# EAGLE design Teknic_motor_io (EAGLE 9.6.2)
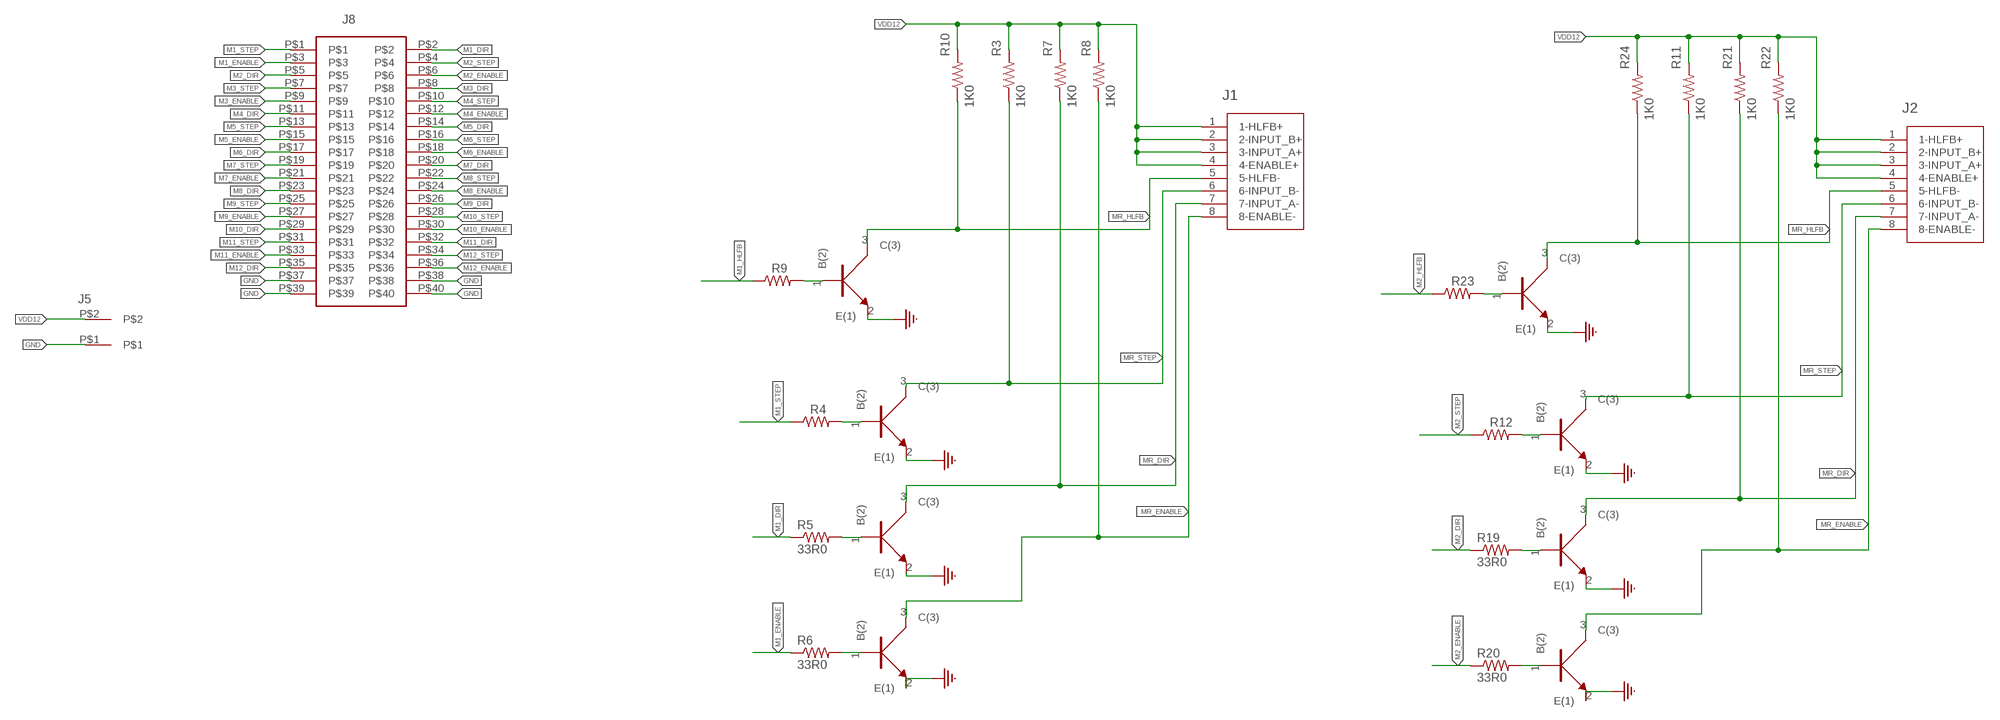
[diagram p0: schematic, sheet 1, part 1 of 3]
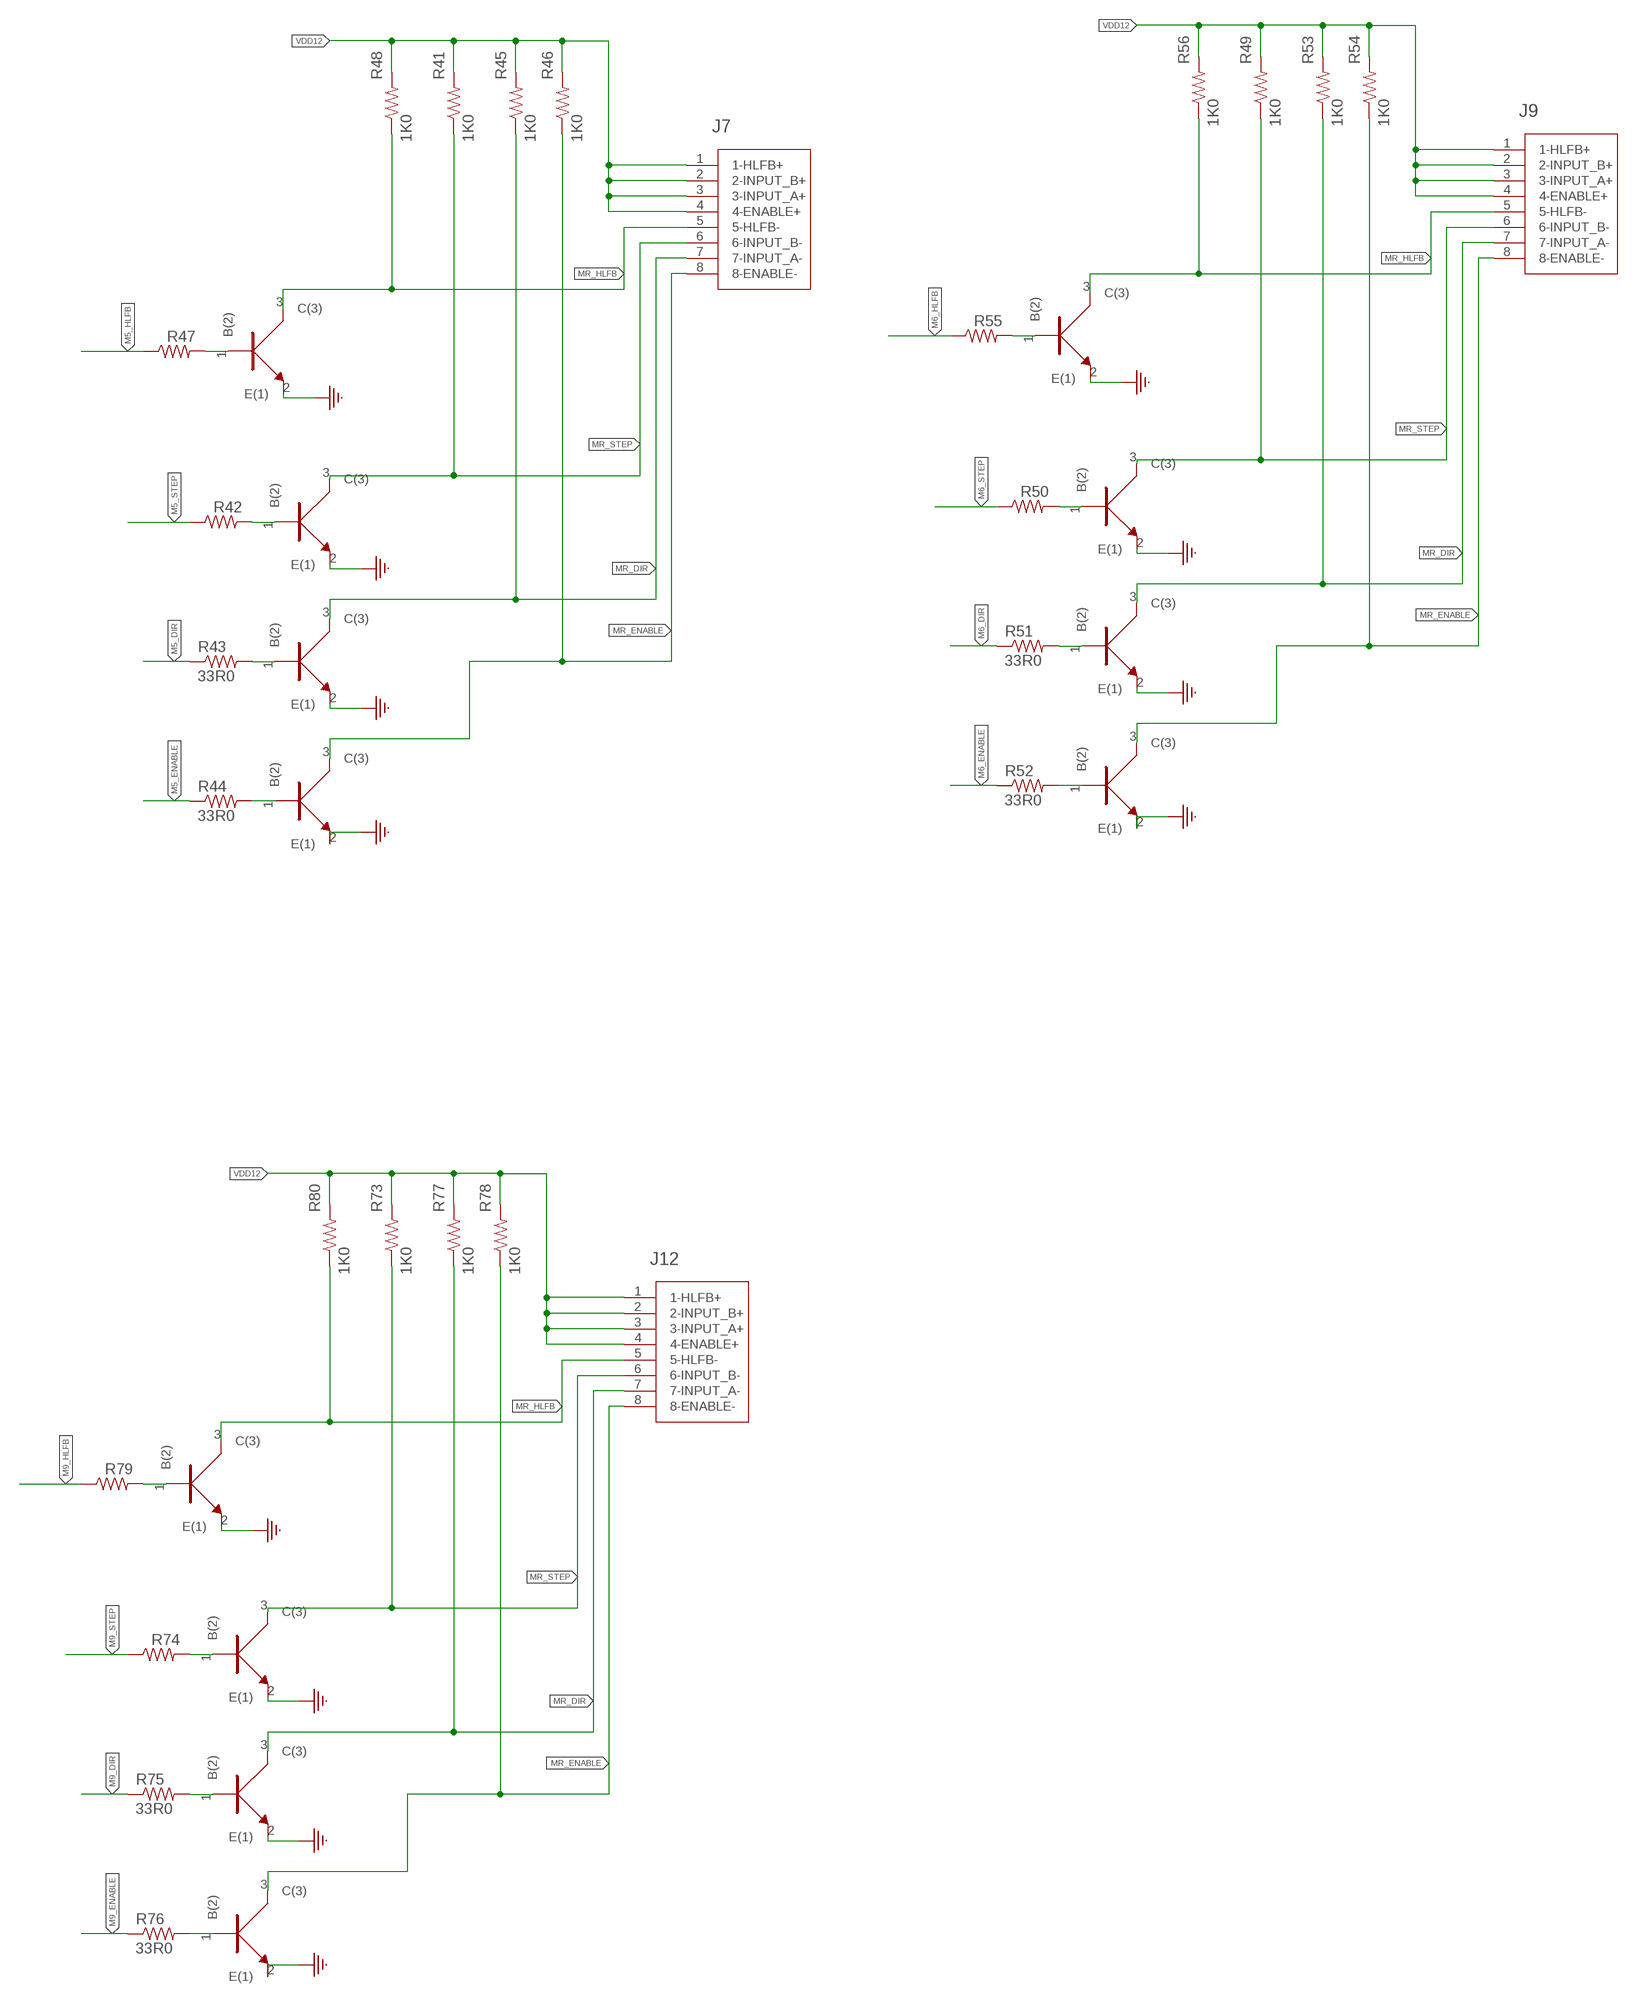
[diagram p1: schematic, sheet 1, part 2 of 3]
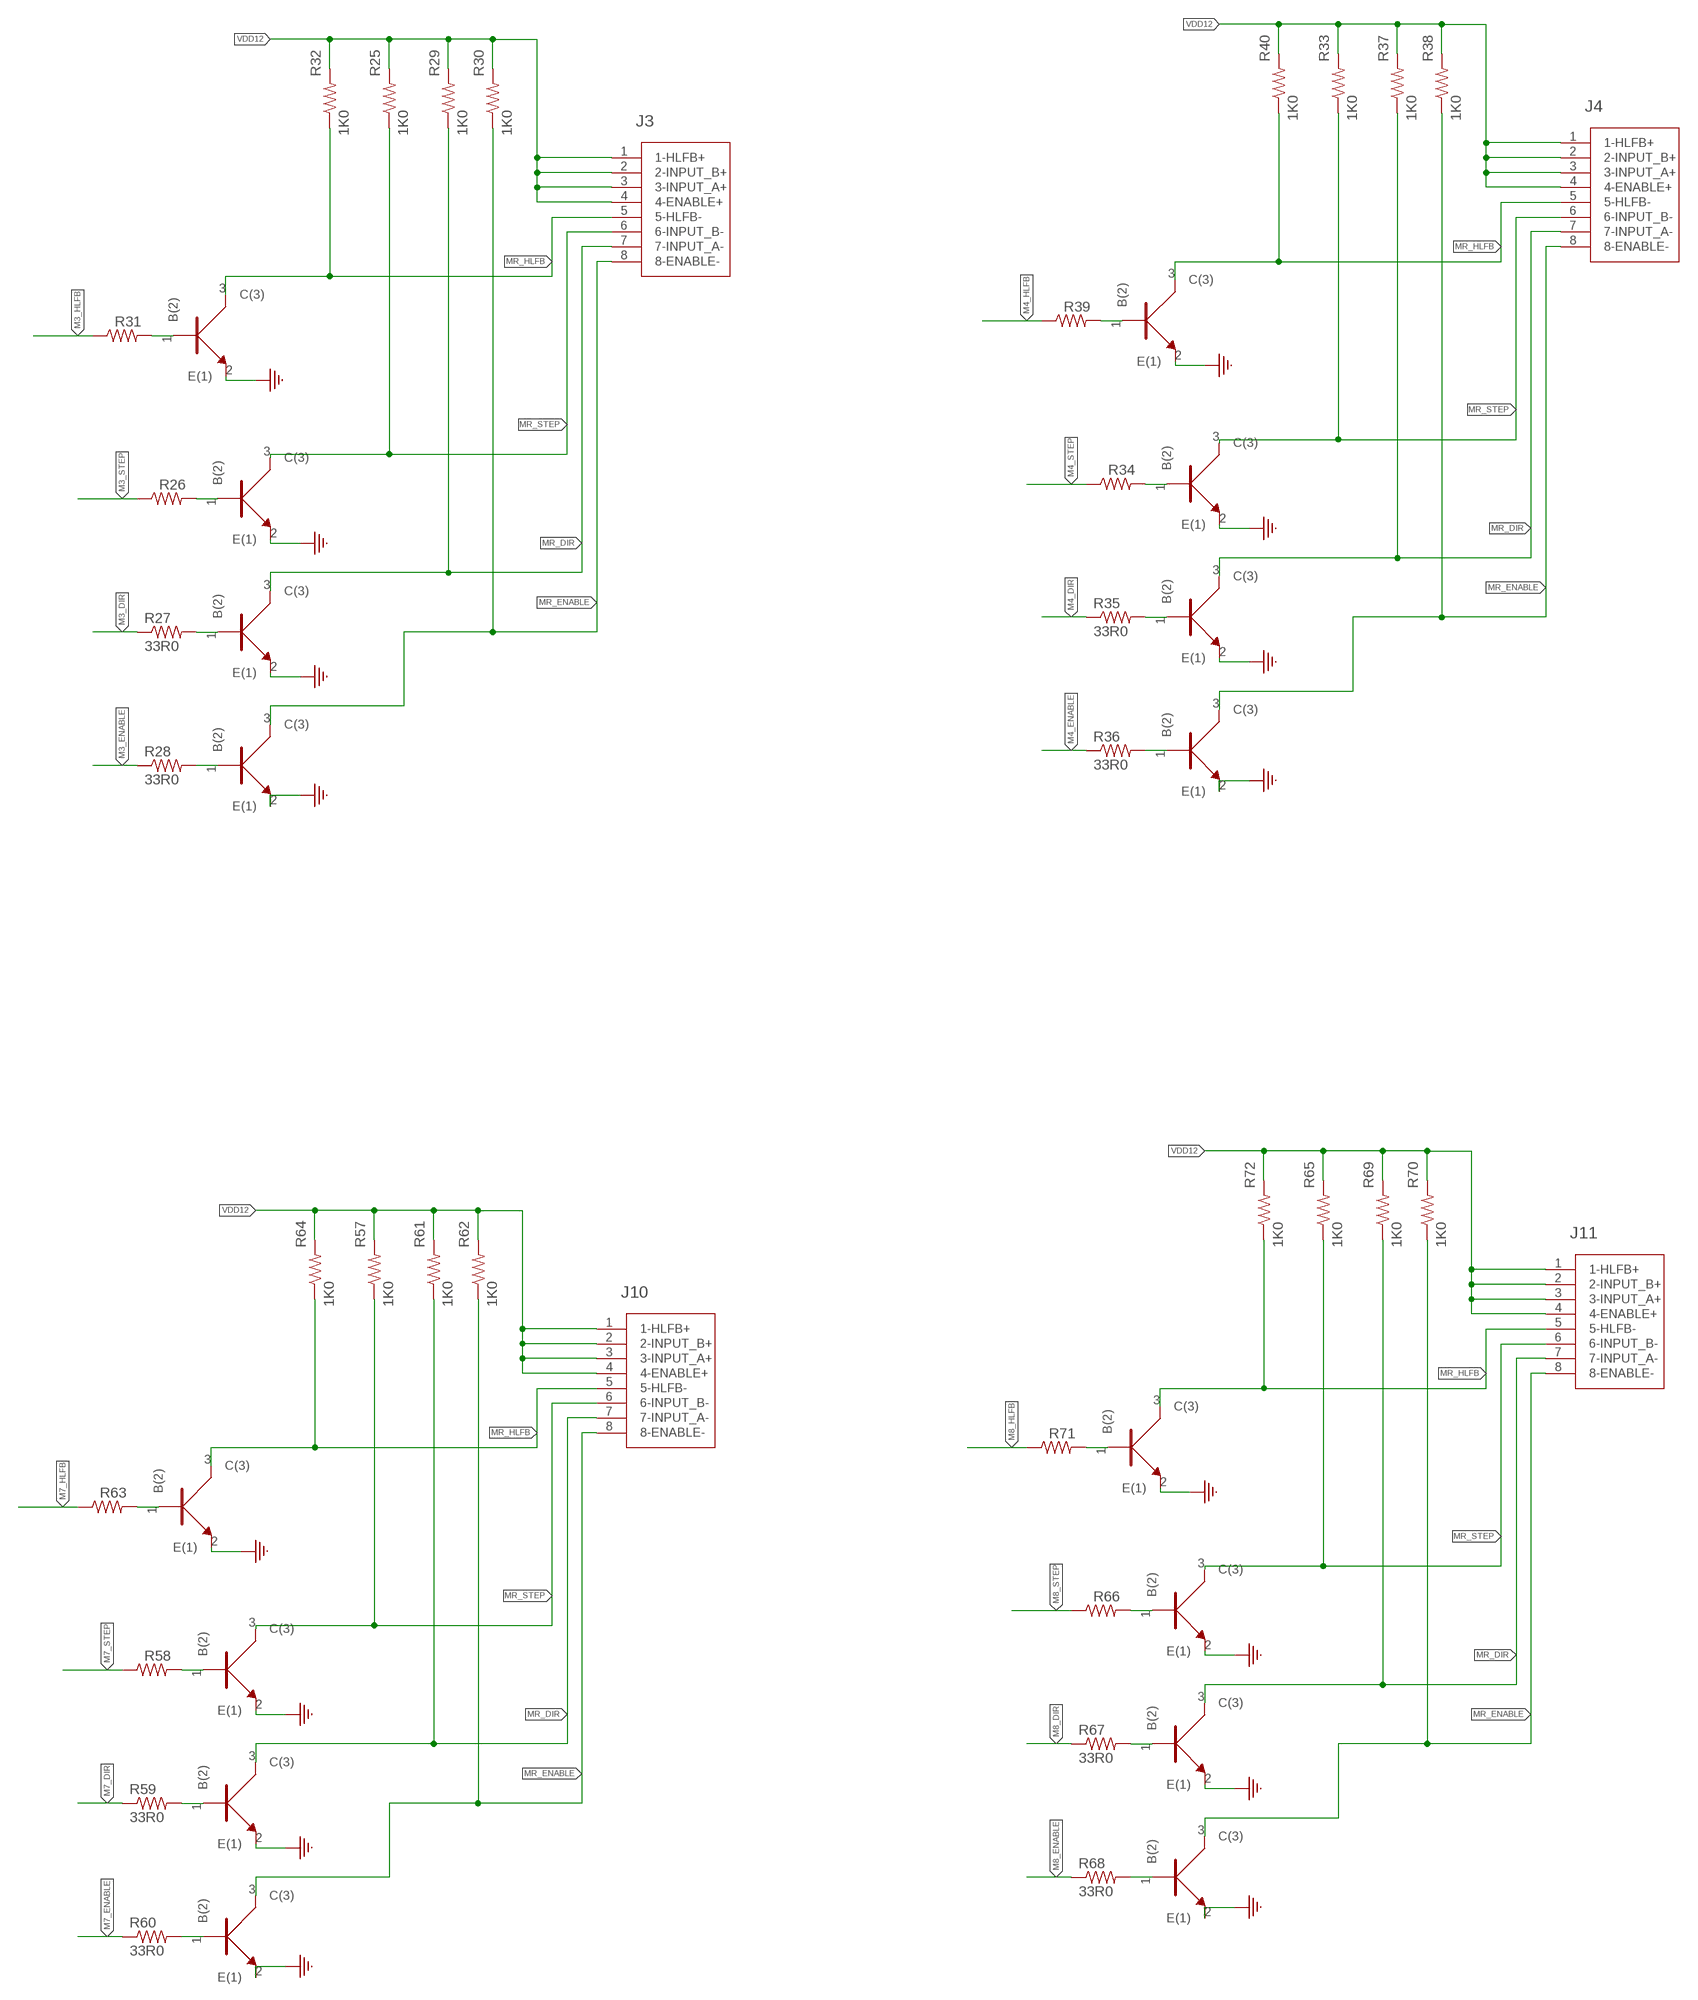
[diagram p2: schematic, sheet 1, part 3 of 3]

## Parts
J1  TEKNIC_8PIN_MOTOR  [CON_39281083]
J2  TEKNIC_8PIN_MOTOR  [CON_39281083]
J3  TEKNIC_8PIN_MOTOR  [CON_39281083]
J4  TEKNIC_8PIN_MOTOR  [CON_39281083]
J5  2-pos  3.81MM_1_X_2_RT_ANGLE_PLUG_HEADER  [2_3.81MM_PITCH]
J7  TEKNIC_8PIN_MOTOR  [CON_39281083]
J8  40-pos  HEADER_2_X_20_GENERIC  [HEADER_2_X_20_.1_INCH]
J9  TEKNIC_8PIN_MOTOR  [CON_39281083]
J10  TEKNIC_8PIN_MOTOR  [CON_39281083]
J11  TEKNIC_8PIN_MOTOR  [CON_39281083]
J12  TEKNIC_8PIN_MOTOR  [CON_39281083]
R3  1K0  R_0402_1K0  [0402]
R4  33R0  R_0402_33R0  [0402]
R5  33R0  R_0402_33R0  [0402]
R6  33R0  R_0402_33R0  [0402]
R7  1K0  R_0402_1K0  [0402]
R8  1K0  R_0402_1K0  [0402]
R9  33R0  R_0402_33R0  [0402]
R10  1K0  R_0402_1K0  [0402]
R11  1K0  R_0402_1K0  [0402]
R12  33R0  R_0402_33R0  [0402]
R19  33R0  R_0402_33R0  [0402]
R20  33R0  R_0402_33R0  [0402]
R21  1K0  R_0402_1K0  [0402]
R22  1K0  R_0402_1K0  [0402]
R23  33R0  R_0402_33R0  [0402]
R24  1K0  R_0402_1K0  [0402]
R25  1K0  R_0402_1K0  [0402]
R26  33R0  R_0402_33R0  [0402]
R27  33R0  R_0402_33R0  [0402]
R28  33R0  R_0402_33R0  [0402]
R29  1K0  R_0402_1K0  [0402]
R30  1K0  R_0402_1K0  [0402]
R31  33R0  R_0402_33R0  [0402]
R32  1K0  R_0402_1K0  [0402]
R33  1K0  R_0402_1K0  [0402]
R34  33R0  R_0402_33R0  [0402]
R35  33R0  R_0402_33R0  [0402]
R36  33R0  R_0402_33R0  [0402]
R37  1K0  R_0402_1K0  [0402]
R38  1K0  R_0402_1K0  [0402]
R39  33R0  R_0402_33R0  [0402]
R40  1K0  R_0402_1K0  [0402]
R41  1K0  R_0402_1K0  [0402]
R42  33R0  R_0402_33R0  [0402]
R43  33R0  R_0402_33R0  [0402]
R44  33R0  R_0402_33R0  [0402]
R45  1K0  R_0402_1K0  [0402]
R46  1K0  R_0402_1K0  [0402]
R47  33R0  R_0402_33R0  [0402]
R48  1K0  R_0402_1K0  [0402]
R49  1K0  R_0402_1K0  [0402]
R50  33R0  R_0402_33R0  [0402]
R51  33R0  R_0402_33R0  [0402]
R52  33R0  R_0402_33R0  [0402]
R53  1K0  R_0402_1K0  [0402]
R54  1K0  R_0402_1K0  [0402]
R55  33R0  R_0402_33R0  [0402]
R56  1K0  R_0402_1K0  [0402]
R57  1K0  R_0402_1K0  [0402]
R58  33R0  R_0402_33R0  [0402]
R59  33R0  R_0402_33R0  [0402]
R60  33R0  R_0402_33R0  [0402]
R61  1K0  R_0402_1K0  [0402]
R62  1K0  R_0402_1K0  [0402]
R63  33R0  R_0402_33R0  [0402]
R64  1K0  R_0402_1K0  [0402]
R65  1K0  R_0402_1K0  [0402]
R66  33R0  R_0402_33R0  [0402]
R67  33R0  R_0402_33R0  [0402]
R68  33R0  R_0402_33R0  [0402]
R69  1K0  R_0402_1K0  [0402]
R70  1K0  R_0402_1K0  [0402]
R71  33R0  R_0402_33R0  [0402]
R72  1K0  R_0402_1K0  [0402]
R73  1K0  R_0402_1K0  [0402]
R74  33R0  R_0402_33R0  [0402]
R75  33R0  R_0402_33R0  [0402]
R76  33R0  R_0402_33R0  [0402]
R77  1K0  R_0402_1K0  [0402]
R78  1K0  R_0402_1K0  [0402]
R79  33R0  R_0402_33R0  [0402]
R80  1K0  R_0402_1K0  [0402]
U2  NPN  BC846BW  [SOT323]
U3  NPN  BC846BW  [SOT323]
U4  NPN  BC846BW  [SOT323]
U5  NPN  BC846BW  [SOT323]
U6  NPN  BC846BW  [SOT323]
U10  NPN  BC846BW  [SOT323]
U11  NPN  BC846BW  [SOT323]
U12  NPN  BC846BW  [SOT323]
U13  NPN  BC846BW  [SOT323]
U14  NPN  BC846BW  [SOT323]
U15  NPN  BC846BW  [SOT323]
U16  NPN  BC846BW  [SOT323]
U17  NPN  BC846BW  [SOT323]
U18  NPN  BC846BW  [SOT323]
U19  NPN  BC846BW  [SOT323]
U20  NPN  BC846BW  [SOT323]
U21  NPN  BC846BW  [SOT323]
U22  NPN  BC846BW  [SOT323]
U23  NPN  BC846BW  [SOT323]
U24  NPN  BC846BW  [SOT323]
U25  NPN  BC846BW  [SOT323]
U26  NPN  BC846BW  [SOT323]
U27  NPN  BC846BW  [SOT323]
U28  NPN  BC846BW  [SOT323]
U29  NPN  BC846BW  [SOT323]
U30  NPN  BC846BW  [SOT323]
U31  NPN  BC846BW  [SOT323]
U32  NPN  BC846BW  [SOT323]
U33  NPN  BC846BW  [SOT323]
U34  NPN  BC846BW  [SOT323]
U35  NPN  BC846BW  [SOT323]
U36  NPN  BC846BW  [SOT323]
U37  NPN  BC846BW  [SOT323]
U38  NPN  BC846BW  [SOT323]
U39  NPN  BC846BW  [SOT323]
U40  NPN  BC846BW  [SOT323]

## Nets
GND: J5.P$1 J8.P$37 J8.P$38 J8.P$39 J8.P$40 U2.2(E(1)) U3.2(E(1)) U4.2(E(1)) U5.2(E(1)) U6.2(E(1)) U10.2(E(1)) U11.2(E(1)) U12.2(E(1)) U13.2(E(1)) U14.2(E(1)) U15.2(E(1)) U16.2(E(1)) U17.2(E(1)) U18.2(E(1)) U19.2(E(1)) U20.2(E(1)) U21.2(E(1)) U22.2(E(1)) U23.2(E(1)) U24.2(E(1)) U25.2(E(1)) U26.2(E(1)) U27.2(E(1)) U28.2(E(1)) U29.2(E(1)) U30.2(E(1)) U31.2(E(1)) U32.2(E(1)) U33.2(E(1)) U34.2(E(1)) U35.2(E(1)) U36.2(E(1)) U37.2(E(1)) U38.2(E(1)) U39.2(E(1)) U40.2(E(1))
M1_DIR: J8.P$2 R5.P$1
M1_ENABLE: J8.P$3 R6.P$1
M1_HLFB: R9.P$1
M1_STEP: J8.P$1 R4.P$1
M2_DIR: J8.P$5 R19.P$1
M2_ENABLE: J8.P$6 R20.P$1
M2_HLFB: R23.P$1
M2_STEP: J8.P$4 R12.P$1
M3_DIR: J8.P$8 R27.P$1
M3_ENABLE: J8.P$9 R28.P$1
M3_HLFB: R31.P$1
M3_STEP: J8.P$7 R26.P$1
M4_DIR: J8.P$11 R35.P$1
M4_ENABLE: J8.P$12 R36.P$1
M4_HLFB: R39.P$1
M4_STEP: J8.P$10 R34.P$1
M5_DIR: J8.P$14 R43.P$1
M5_ENABLE: J8.P$15 R44.P$1
M5_HLFB: R47.P$1
M5_STEP: J8.P$13 R42.P$1
M6_DIR: J8.P$17 R51.P$1
M6_ENABLE: J8.P$18 R52.P$1
M6_HLFB: R55.P$1
M6_STEP: J8.P$16 R50.P$1
M7_DIR: J8.P$20 R59.P$1
M7_ENABLE: J8.P$21 R60.P$1
M7_HLFB: R63.P$1
M7_STEP: J8.P$19 R58.P$1
M8_DIR: J8.P$23 R67.P$1
M8_ENABLE: J8.P$24 R68.P$1
M8_HLFB: R71.P$1
M8_STEP: J8.P$22 R66.P$1
M9_DIR: J8.P$26 R75.P$1
M9_ENABLE: J8.P$27 R76.P$1
M9_HLFB: R79.P$1
M9_STEP: J8.P$25 R74.P$1
M10_DIR: J8.P$29
M10_ENABLE: J8.P$30
M10_STEP: J8.P$28
M11_DIR: J8.P$32
M11_ENABLE: J8.P$33
M11_STEP: J8.P$31
M12_DIR: J8.P$35
M12_ENABLE: J8.P$36
M12_STEP: J8.P$34
MR_DIR: J1.7(7-INPUT_A-) J2.7(7-INPUT_A-) J3.7(7-INPUT_A-) J4.7(7-INPUT_A-) J7.7(7-INPUT_A-) J9.7(7-INPUT_A-) J10.7(7-INPUT_A-) J11.7(7-INPUT_A-) J12.7(7-INPUT_A-) R7.P$1 R21.P$1 R29.P$1 R37.P$1 R45.P$1 R53.P$1 R61.P$1 R69.P$1 R77.P$1 U3.3(C(3)) U10.3(C(3)) U14.3(C(3)) U18.3(C(3)) U22.3(C(3)) U26.3(C(3)) U30.3(C(3)) U34.3(C(3)) U38.3(C(3))
MR_ENABLE: J1.8(8-ENABLE-) J2.8(8-ENABLE-) J3.8(8-ENABLE-) J4.8(8-ENABLE-) J7.8(8-ENABLE-) J9.8(8-ENABLE-) J10.8(8-ENABLE-) J11.8(8-ENABLE-) J12.8(8-ENABLE-) R8.P$1 R22.P$1 R30.P$1 R38.P$1 R46.P$1 R54.P$1 R62.P$1 R70.P$1 R78.P$1 U4.3(C(3)) U11.3(C(3)) U15.3(C(3)) U19.3(C(3)) U23.3(C(3)) U27.3(C(3)) U31.3(C(3)) U35.3(C(3)) U39.3(C(3))
MR_HLFB: J1.5(5-HLFB-) J2.5(5-HLFB-) J3.5(5-HLFB-) J4.5(5-HLFB-) J7.5(5-HLFB-) J9.5(5-HLFB-) J10.5(5-HLFB-) J11.5(5-HLFB-) J12.5(5-HLFB-) R10.P$1 R24.P$1 R32.P$1 R40.P$1 R48.P$1 R56.P$1 R64.P$1 R72.P$1 R80.P$1 U5.3(C(3)) U12.3(C(3)) U16.3(C(3)) U20.3(C(3)) U24.3(C(3)) U28.3(C(3)) U32.3(C(3)) U36.3(C(3)) U40.3(C(3))
MR_STEP: J1.6(6-INPUT_B-) J2.6(6-INPUT_B-) J3.6(6-INPUT_B-) J4.6(6-INPUT_B-) J7.6(6-INPUT_B-) J9.6(6-INPUT_B-) J10.6(6-INPUT_B-) J11.6(6-INPUT_B-) J12.6(6-INPUT_B-) R3.P$1 R11.P$1 R25.P$1 R33.P$1 R41.P$1 R49.P$1 R57.P$1 R65.P$1 R73.P$1 U2.3(C(3)) U6.3(C(3)) U13.3(C(3)) U17.3(C(3)) U21.3(C(3)) U25.3(C(3)) U29.3(C(3)) U33.3(C(3)) U37.3(C(3))
N$2: R5.P$2 U3.1(B(2))
N$3: R6.P$2 U4.1(B(2))
N$4: R4.P$2 U2.1(B(2))
N$5: R9.P$2 U5.1(B(2))
N$6: R19.P$2 U10.1(B(2))
N$7: R20.P$2 U11.1(B(2))
N$8: R12.P$2 U6.1(B(2))
N$9: R23.P$2 U12.1(B(2))
N$13: R27.P$2 U14.1(B(2))
N$14: R28.P$2 U15.1(B(2))
N$15: R26.P$2 U13.1(B(2))
N$16: R31.P$2 U16.1(B(2))
N$17: R35.P$2 U18.1(B(2))
N$18: R36.P$2 U19.1(B(2))
N$19: R34.P$2 U17.1(B(2))
N$20: R39.P$2 U20.1(B(2))
N$21: R43.P$2 U22.1(B(2))
N$22: R44.P$2 U23.1(B(2))
N$23: R42.P$2 U21.1(B(2))
N$24: R47.P$2 U24.1(B(2))
N$25: R51.P$2 U26.1(B(2))
N$26: R52.P$2 U27.1(B(2))
N$27: R50.P$2 U25.1(B(2))
N$28: R55.P$2 U28.1(B(2))
N$29: R59.P$2 U30.1(B(2))
N$30: R60.P$2 U31.1(B(2))
N$31: R58.P$2 U29.1(B(2))
N$32: R63.P$2 U32.1(B(2))
N$33: R67.P$2 U34.1(B(2))
N$34: R68.P$2 U35.1(B(2))
N$35: R66.P$2 U33.1(B(2))
N$36: R71.P$2 U36.1(B(2))
N$37: R75.P$2 U38.1(B(2))
N$38: R76.P$2 U39.1(B(2))
N$39: R74.P$2 U37.1(B(2))
N$40: R79.P$2 U40.1(B(2))
VDD12: J1.1(1-HLFB+) J1.2(2-INPUT_B+) J1.3(3-INPUT_A+) J1.4(4-ENABLE+) J2.1(1-HLFB+) J2.2(2-INPUT_B+) J2.3(3-INPUT_A+) J2.4(4-ENABLE+) J3.1(1-HLFB+) J3.2(2-INPUT_B+) J3.3(3-INPUT_A+) J3.4(4-ENABLE+) J4.1(1-HLFB+) J4.2(2-INPUT_B+) J4.3(3-INPUT_A+) J4.4(4-ENABLE+) J5.P$2 J7.1(1-HLFB+) J7.2(2-INPUT_B+) J7.3(3-INPUT_A+) J7.4(4-ENABLE+) J9.1(1-HLFB+) J9.2(2-INPUT_B+) J9.3(3-INPUT_A+) J9.4(4-ENABLE+) J10.1(1-HLFB+) J10.2(2-INPUT_B+) J10.3(3-INPUT_A+) J10.4(4-ENABLE+) J11.1(1-HLFB+) J11.2(2-INPUT_B+) J11.3(3-INPUT_A+) J11.4(4-ENABLE+) J12.1(1-HLFB+) J12.2(2-INPUT_B+) J12.3(3-INPUT_A+) J12.4(4-ENABLE+) R3.P$2 R7.P$2 R8.P$2 R10.P$2 R11.P$2 R21.P$2 R22.P$2 R24.P$2 R25.P$2 R29.P$2 R30.P$2 R32.P$2 R33.P$2 R37.P$2 R38.P$2 R40.P$2 R41.P$2 R45.P$2 R46.P$2 R48.P$2 R49.P$2 R53.P$2 R54.P$2 R56.P$2 R57.P$2 R61.P$2 R62.P$2 R64.P$2 R65.P$2 R69.P$2 R70.P$2 R72.P$2 R73.P$2 R77.P$2 R78.P$2 R80.P$2

## Library data of the parts
J1-J4 J7 J9-J12 = 3D_MIG_Controller:TEKNIC_8PIN_MOTOR; COPYRIGHT: Copyright (C) 2022 Ultra Librarian. All rights reserved.; MANUFACTURER_PART_NUMBER: 39281083; MFR_NAME: Molex Connector Corporation
J5 = 3D_MIG_Controller:3.81MM_1_X_2_RT_ANGLE_PLUG_HEADER: TERM BLOCK HDR 2POS 90DEG 3.81MM; PARTNO: 691322310002
J8 = 3D_MIG_Controller:HEADER_2_X_20_GENERIC: CONN HEADER R/A 40POS 2.54MM; PARTNO: 61304021021
R3 R7 R8 R10 R11 R21 R22 R24 R25 R29 R30 R32 R33 R37 R38 R40 R41 R45 R46 R48 R49 R53 R54 R56 R57 R61 R62 R64 R65 R69 R70 R72 R73 R77 R78 R80 = 3D_MIG_Controller:R_0402_1K0; PARTNO: CRG0402J1K0
R4-R6 R9 R12 R19 R20 R23 R26-R28 R31 R34-R36 R39 R42-R44 R47 R50-R52 R55 R58-R60 R63 R66-R68 R71 R74-R76 R79 = 3D_MIG_Controller:R_0402_33R0; PARTNO: RMCF0402JT33R0
U2-U6 U10-U40 = 3D_MIG_Controller:BC846BW: Bipolar (BJT) Transistor NPN 100MHz Surface Mount SOT-323; PARTNO: BC846BW_NPN

## Board
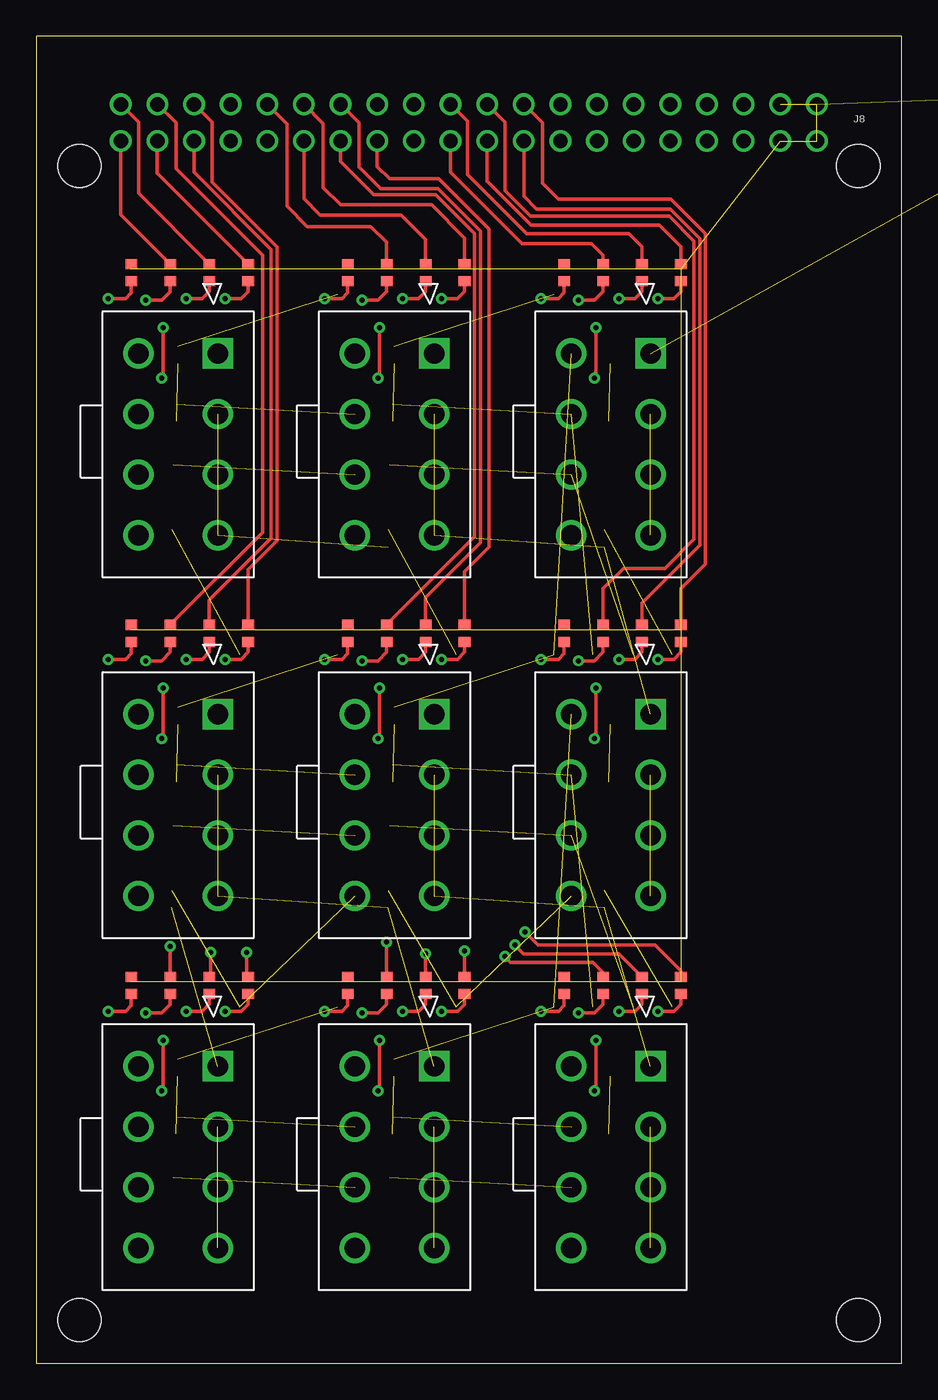
[diagram p3: board, top side]
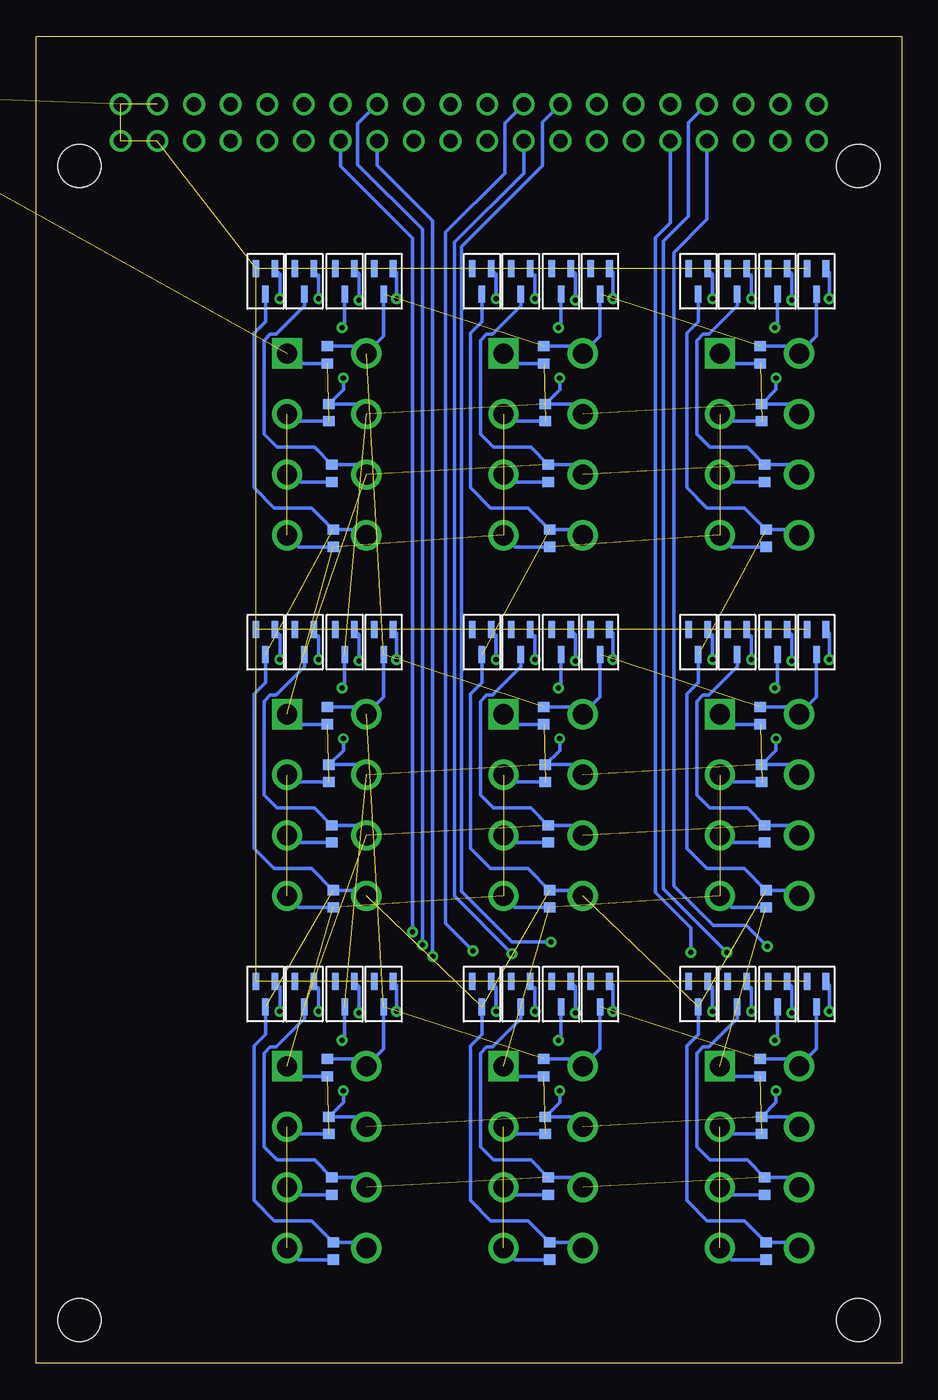
[diagram p4: board, bottom side, seen from below]

Size 60 x 92 mm. Coordinates in mm from the lower left corner, seen from the top.
Outline: 0,0 60,0 60,92 0,92 0,0
Copper layers (1*16): Top 0.035mm / dielectric 1.5mm / Bottom 0.035mm
Design rules "default": minimum track width 6mil, minimum drill 0.35mm, track to track 6mil, track to pad 6mil, pad to pad 6mil, via to via 6mil, smd to smd 6mil, copper to edge 40mil, drill to drill 6mil, minimum pad ring 10mil, minimum via ring 8mil, stop-mask expansion 4mil, vias tented up to drill 0mil, thermal gap 10mil
Holes 3 mm at 3,3 57,3 3,83 57,83

### Footprints (pad centres in the part's own frame; a part is rotated, then mirrored left to right if it is on the bottom)
CON_39281083 = drill 1.397 pad 1.905 square: 1 12.6,-5.5 | drill 1.397 pad 1.905: 2 8.4,-5.5; 3 4.2,-5.5; 4 0,-5.5; 5 12.6,0; 6 8.4,0; 7 4.2,0; 8 0,0
2_3.81MM_PITCH = drill 1.1 pad 2 long: P$1 0,0; P$2 3.81,0
HEADER_2_X_20_.1_INCH = drill 1: P$1 -24.13,-1.27; P$2 -24.13,1.27; P$3 -21.59,-1.27; P$4 -21.59,1.27; P$5 -19.05,-1.27; P$6 -19.05,1.27; P$7 -16.51,-1.27; P$8 -16.51,1.27; P$9 -13.97,-1.27; P$10 -13.97,1.27; P$11 -11.43,-1.27; P$12 -11.43,1.27; P$13 -8.89,-1.27; P$14 -8.89,1.27; P$15 -6.35,-1.27; P$16 -6.35,1.27; P$17 -3.81,-1.27; P$18 -3.81,1.27; P$19 -1.27,-1.27; P$20 -1.27,1.27; P$21 1.27,-1.27; P$22 1.27,1.27; P$23 3.81,-1.27; P$24 3.81,1.27; P$25 6.35,-1.27; P$26 6.35,1.27; P$27 8.89,-1.27; P$28 8.89,1.27; P$29 11.43,-1.27; P$30 11.43,1.27; P$31 13.97,-1.27; P$32 13.97,1.27; P$33 16.51,-1.27; P$34 16.51,1.27; P$35 19.05,-1.27; P$36 19.05,1.27; P$37 21.59,-1.27; P$38 21.59,1.27; P$39 24.13,-1.27; P$40 24.13,1.27
0402 = smd 0.8 x 0.7: P$1 0,0.6; P$2 0,-0.6
SOT323 = smd 0.457 x 1.168: 1 -0.65,-0.876; 2 0.65,-0.876; 3 0,0.876

### Placement (x,y rotation side)
J1  7.1,57.4 90 top
J2  7.1,32.4 90 top
J3  7.1,8 90 top
J4  22.1,57.4 90 top
J5  82.4,88.3 90 top  (outside the outline)
J7  22.1,32.4 90 top
J8  30,86 0 top
J9  22.1,8 90 top
J10  37.1,57.4 90 top
J11  37.1,32.4 90 top
J12  37.1,8 90 top
R3  9.7,65.9 0 bottom
R4  9.3,75.6 0 top
R5  12,75.6 0 top
R6  14.7,75.6 0 top
R7  9.5,61.7 0 bottom
R8  9.4,57.2 0 bottom
R9  6.6,75.6 0 top
R10  9.8,69.9 0 bottom
R11  9.7,40.9 0 bottom
R12  9.3,50.6 0 top
R19  12,50.6 0 top
R20  14.7,50.6 0 top
R21  9.5,36.7 0 bottom
R22  9.4,32.2 0 bottom
R23  6.6,50.6 0 top
R24  9.8,44.9 0 bottom
R25  9.7,16.5 0 bottom
R26  9.3,26.2 0 top
R27  12,26.2 0 top
R28  14.7,26.2 0 top
R29  9.5,12.3 0 bottom
R30  9.4,7.8 0 bottom
R31  6.6,26.2 0 top
R32  9.8,20.5 0 bottom
R33  24.7,65.9 0 bottom
R34  24.3,75.6 0 top
R35  27,75.6 0 top
R36  29.7,75.6 0 top
R37  24.5,61.7 0 bottom
R38  24.4,57.2 0 bottom
R39  21.6,75.6 0 top
R40  24.8,69.9 0 bottom
R41  24.7,40.9 0 bottom
R42  24.3,50.6 0 top
R43  27,50.6 0 top
R44  29.7,50.6 0 top
R45  24.5,36.7 0 bottom
R46  24.4,32.2 0 bottom
R47  21.6,50.6 0 top
R48  24.8,44.9 0 bottom
R49  24.7,16.5 0 bottom
R50  24.3,26.2 0 top
R51  27,26.2 0 top
R52  29.7,26.2 0 top
R53  24.5,12.3 0 bottom
R54  24.4,7.8 0 bottom
R55  21.6,26.2 0 top
R56  24.8,20.5 0 bottom
R57  39.7,65.9 0 bottom
R58  39.3,75.6 0 top
R59  42,75.6 0 top
R60  44.7,75.6 0 top
R61  39.5,61.7 0 bottom
R62  39.4,57.2 0 bottom
R63  36.6,75.6 0 top
R64  39.8,69.9 0 bottom
R65  39.7,40.9 0 bottom
R66  39.3,50.6 0 top
R67  42,50.6 0 top
R68  44.7,50.6 0 top
R69  39.5,36.7 0 bottom
R70  39.4,32.2 0 bottom
R71  36.6,50.6 0 top
R72  39.8,44.9 0 bottom
R73  39.7,16.5 0 bottom
R74  39.3,26.2 0 top
R75  42,26.2 0 top
R76  44.7,26.2 0 top
R77  39.5,12.3 0 bottom
R78  39.4,7.8 0 bottom
R79  36.6,26.2 0 top
R80  39.8,20.5 0 bottom
U2  8.6,75 180 bottom
U3  11.4,75 180 bottom
U4  14.1,75 180 bottom
U5  5.9,75 180 bottom
U6  8.6,50 180 bottom
U10  11.4,50 180 bottom
U11  14.1,50 180 bottom
U12  5.9,50 180 bottom
U13  8.6,25.6 180 bottom
U14  11.4,25.6 180 bottom
U15  14.1,25.6 180 bottom
U16  5.9,25.6 180 bottom
U17  23.6,75 180 bottom
U18  26.4,75 180 bottom
U19  29.1,75 180 bottom
U20  20.9,75 180 bottom
U21  23.6,50 180 bottom
U22  26.4,50 180 bottom
U23  29.1,50 180 bottom
U24  20.9,50 180 bottom
U25  23.6,25.6 180 bottom
U26  26.4,25.6 180 bottom
U27  29.1,25.6 180 bottom
U28  20.9,25.6 180 bottom
U29  38.6,75 180 bottom
U30  41.4,75 180 bottom
U31  44.1,75 180 bottom
U32  35.9,75 180 bottom
U33  38.6,50 180 bottom
U34  41.4,50 180 bottom
U35  44.1,50 180 bottom
U36  35.9,50 180 bottom
U37  38.6,25.6 180 bottom
U38  41.4,25.6 180 bottom
U39  44.1,25.6 180 bottom
U40  35.9,25.6 180 bottom

### Tracks (layer width: path | path; a pad name or v marks a point on that pad's centre or on a via)
GND  (40 unrouted)
M1_DIR
  Top 0.254: R5.P$1 7.1,81.1 7.1,86.04 J8.P$2
M1_ENABLE
  Top 0.254: R6.P$1 8.41,82.49 J8.P$3
M1_STEP
  Top 0.254: R4.P$1 5.87,79.63 J8.P$1
M2_DIR
  Top 0.254: R19.P$1 12,52.9 16.3,57.2 16.3,77.2 10.95,82.55 J8.P$5
M2_ENABLE
  Top 0.254: R20.P$1 14.7,55.02 16.71,57.03 16.71,77.37 12.2,81.88 12.2,86.02 J8.P$6
M2_STEP
  Top 0.254: R12.P$1 15.7,57.6 15.7,76.8 9.7,82.8 9.7,85.98 J8.P$4
M3_DIR  (via drill 0.35)
  Top 0.254: R27.P$1 12.1,26.9 v12.1,28.5
  Bottom 0.254: v12.1,28.5 16.5,32.9 16.5,77.8 14.78,79.52 14.78,85.98 J8.P$8
M3_ENABLE  (via drill 0.35)
  Top 0.254: R28.P$1 14.6,26.9 v14.6,28.5
  Bottom 0.254: J8.P$9 16.03,79.07 17.06,78.04 17.06,32.66 14.6,30.2 v14.6,28.5
M3_STEP  (via drill 0.35)
  Top 0.254: R26.P$1 v9.3,28.9
  Bottom 0.254: v9.3,28.9 10.75,30.35 13.05,30.35 15.8,33.1 15.8,77 13.49,79.31 J8.P$7
M4_DIR
  Top 0.254: R35.P$1 27,77.9 25.3,79.6 19.7,79.6 18.57,80.73 J8.P$11
M4_ENABLE
  Top 0.254: R36.P$1 29.7,78 27.4,80.3 21.1,80.3 19.9,81.5 19.9,85.94 J8.P$12
M4_STEP
  Top 0.254: J8.P$10 17.4,85.9 17.4,80.2 18.8,78.8 23.2,78.8 24.3,77.7 R34.P$1
M5_DIR
  Top 0.254: J8.P$14 22.4,85.98 22.4,82.9 23.89,81.41 27.87,81.41 30.81,78.47 30.81,56.91 27,53.1 R43.P$1
M5_ENABLE
  Top 0.254: R44.P$1 29.7,54.9 31.4,56.6 31.4,78.6 27.9,82.1 24.5,82.1 23.65,82.95 J8.P$15
M5_STEP
  Top 0.254: R42.P$1 30.4,57.3 30.4,78.3 27.7,81 23.4,81 21.11,83.29 J8.P$13
M6_DIR  (via drill 0.35)
  Top 0.254: R51.P$1 v27,28.4
  Bottom 0.254: v27,28.4 31,32.4 31,77.7 26.19,82.51 J8.P$17
M6_ENABLE  (via drill 0.35)
  Top 0.254: R52.P$1 v29.7,28.6
  Bottom 0.254: v29.7,28.6 31.6,30.5 31.6,78.4 27.5,82.5 27.5,85.96 J8.P$18
M6_STEP  (via drill 0.35)
  Top 0.254: R50.P$1 v24.3,29.2
  Bottom 0.254: v24.3,29.2 27,29.2 30.5,32.7 30.5,77.4 24.9,83 24.9,86.02 J8.P$16
M7_DIR
  Top 0.254: R59.P$1 42,77.4 41.1,78.3 34,78.3 29.9,82.4 29.9,86.1 J8.P$20
M7_ENABLE
  Top 0.254: R60.P$1 44.7,77.4 43.2,78.9 34.3,78.9 31.27,81.93 J8.P$21
M7_STEP
  Top 0.254: R58.P$1 39.3,76.8 38.5,77.6 33.7,77.6 28.73,82.57 J8.P$19
M8_DIR
  Top 0.254: J8.P$23 33.81,80.89 34.7,80 43.98,80 46.01,77.97 46.01,56.71 42,52.7 R67.P$1
M8_ENABLE
  Top 0.254: R68.P$1 44.7,53.7 46.41,55.41 46.41,78.29 44,80.7 36.2,80.7 35.1,81.8 35.1,85.98 J8.P$24
M8_STEP
  Top 0.254: R66.P$1 39.3,53.7 40.7,55.1 43.58,55.1 45.6,57.12 45.6,77.8 43.9,79.5 34.27,79.5 32.5,81.28 32.5,86.04 J8.P$22
M9_DIR  (via drill 0.35)
  Top 0.254: v33.2,29 33.8,28.4 40.4,28.4 R75.P$1
  Bottom 0.254: J8.P$26 37.7,85.92 37.7,83.1 33.2,78.6 v33.2,29
M9_ENABLE  (via drill 0.35)
  Top 0.254: R76.P$1 44.7,27.2 42.9,29 34.8,29 v33.9,29.9
  Bottom 0.254: v33.9,29.9 33.9,78 38.89,82.99 J8.P$27
M9_STEP  (via drill 0.35)
  Top 0.254: R74.P$1 39.3,27.1 38.6,27.8 32.9,27.8 v32.5,28.2
  Bottom 0.254: J8.P$25 36.35,83.05 32.5,79.2 v32.5,28.2
MR_DIR  (8 unrouted)
  Bottom 0.254: J1.7 7.8,62.3 R7.P$1 10.7,63.5 13.3,63.5 14.2,64.4 14.2,70.89 13.76,71.33 13.37,71.33 11.4,73.3 U3.3 | J2.7 7.8,37.3 R21.P$1 10.7,38.5 13.3,38.5 14.2,39.4 14.2,45.89 13.76,46.33 13.37,46.33 11.4,48.3 U10.3 | J3.7 7.8,12.9 R29.P$1 10.7,14.1 13.3,14.1 14.2,15 14.2,21.49 13.76,21.93 13.37,21.93 11.4,23.9 U14.3 | J4.7 22.8,62.3 R37.P$1 25.7,63.5 28.3,63.5 29.2,64.4 29.2,70.89 28.76,71.33 28.37,71.33 26.4,73.3 U18.3 | J7.7 22.8,37.3 R45.P$1 25.7,38.5 28.3,38.5 29.2,39.4 29.2,45.89 28.76,46.33 28.37,46.33 26.4,48.3 U22.3 | J9.7 22.8,12.9 R53.P$1 25.7,14.1 28.3,14.1 29.2,15 29.2,21.49 28.76,21.93 28.37,21.93 26.4,23.9 U26.3 | J10.7 37.8,62.3 R61.P$1 40.7,63.5 43.3,63.5 44.2,64.4 44.2,70.89 43.76,71.33 43.37,71.33 41.4,73.3 U30.3 | J11.7 37.8,37.3 R69.P$1 40.7,38.5 43.3,38.5 44.2,39.4 44.2,45.89 43.76,46.33 43.37,46.33 41.4,48.3 U34.3 | J12.7 37.8,12.9 R77.P$1 40.7,14.1 43.3,14.1 44.2,15 44.2,21.49 43.76,21.93 43.37,21.93 41.4,23.9 U38.3
MR_ENABLE  (8 unrouted)
  Bottom 0.254: J1.8 7.5,57.8 R8.P$1 10.9,59.3 13.5,59.3 14.9,60.7 14.9,71.4 14.1,72.2 U4.3 | J2.8 7.5,32.8 R22.P$1 10.9,34.3 13.5,34.3 14.9,35.7 14.9,46.4 14.1,47.2 U11.3 | J3.8 7.5,8.4 R30.P$1 10.9,9.9 13.5,9.9 14.9,11.3 14.9,22 14.1,22.8 U15.3 | J4.8 22.5,57.8 R38.P$1 25.9,59.3 28.5,59.3 29.9,60.7 29.9,71.4 29.1,72.2 U19.3 | J7.8 22.5,32.8 R46.P$1 25.9,34.3 28.5,34.3 29.9,35.7 29.9,46.4 29.1,47.2 U23.3 | J9.8 22.5,8.4 R54.P$1 25.9,9.9 28.5,9.9 29.9,11.3 29.9,22 29.1,22.8 U27.3 | J10.8 37.5,57.8 R62.P$1 40.9,59.3 43.5,59.3 44.9,60.7 44.9,71.4 44.1,72.2 U31.3 | J11.8 37.5,32.8 R70.P$1 40.9,34.3 43.5,34.3 44.9,35.7 44.9,46.4 44.1,47.2 U35.3 | J12.8 37.5,8.4 R78.P$1 40.9,9.9 43.5,9.9 44.9,11.3 44.9,22 44.1,22.8 U39.3
MR_HLFB  (8 unrouted)
  Bottom 0.254: R10.P$1 7.6,70.5 J1.5 5.9,71.2 U5.3 | R24.P$1 7.6,45.5 J2.5 5.9,46.2 U12.3 | R32.P$1 7.6,21.1 J3.5 5.9,21.8 U16.3 | R40.P$1 22.6,70.5 J4.5 20.9,71.2 U20.3 | R48.P$1 22.6,45.5 J7.5 20.9,46.2 U24.3 | R56.P$1 22.6,21.1 J9.5 20.9,21.8 U28.3 | R64.P$1 37.6,70.5 J10.5 35.9,71.2 U32.3 | R72.P$1 37.6,45.5 J11.5 35.9,46.2 U36.3 | R80.P$1 37.6,21.1 J12.5 35.9,21.8 U40.3
MR_STEP  (via drill 0.35)  (8 unrouted)
  Top 0.254: v8.8,71.8 8.8,68.4 v8.7,68.3 | v8.8,46.8 8.8,43.4 v8.7,43.3 | v8.8,22.4 8.8,19 v8.7,18.9 | v23.8,71.8 23.8,68.4 v23.7,68.3 | v23.8,46.8 23.8,43.4 v23.7,43.3 | v23.8,22.4 23.8,19 v23.7,18.9 | v38.8,71.8 38.8,68.4 v38.7,68.3 | v38.8,46.8 38.8,43.4 v38.7,43.3 | v38.8,22.4 38.8,19 v38.7,18.9
  Bottom 0.254: J1.6 7.8,66.5 R3.P$1 8.7,67.5 v8.7,68.3 | U2.3 8.6,72.5 8.6,72 v8.8,71.8 | J2.6 7.8,41.5 R11.P$1 8.7,42.5 v8.7,43.3 | U6.3 8.6,47.5 8.6,47 v8.8,46.8 | J3.6 7.8,17.1 R25.P$1 8.7,18.1 v8.7,18.9 | U13.3 8.6,23.1 8.6,22.6 v8.8,22.4 | J4.6 22.8,66.5 R33.P$1 23.7,67.5 v23.7,68.3 | U17.3 23.6,72.5 23.6,72 v23.8,71.8 | J7.6 22.8,41.5 R41.P$1 23.7,42.5 v23.7,43.3 | U21.3 23.6,47.5 23.6,47 v23.8,46.8 | J9.6 22.8,17.1 R49.P$1 23.7,18.1 v23.7,18.9 | U25.3 23.6,23.1 23.6,22.6 v23.8,22.4 | J10.6 37.8,66.5 R57.P$1 38.7,67.5 v38.7,68.3 | U29.3 38.6,72.5 38.6,72 v38.8,71.8 | J11.6 37.8,41.5 R65.P$1 38.7,42.5 v38.7,43.3 | U33.3 38.6,47.5 38.6,47 v38.8,46.8 | J12.6 37.8,17.1 R73.P$1 38.7,18.1 v38.7,18.9 | U37.3 38.6,23.1 38.6,22.6 v38.8,22.4
N$2  (via drill 0.35)
  Top 0.254: R5.P$2 12,74.3 11.5,73.8 v10.4,73.8
  Bottom 0.254: v10.4,73.8 10.4,75.42 10.5,75.43 10.75,75.68 U3.1
N$3  (via drill 0.35)
  Top 0.254: R6.P$2 14.7,74.3 14.2,73.8 v13.1,73.8
  Bottom 0.254: v13.1,73.8 13.1,75.5 13.45,75.85 U4.1
N$4  (via drill 0.35)
  Top 0.254: R4.P$2 9.3,74.3 8.7,73.7 v7.6,73.7
  Bottom 0.254: v7.6,73.7 7.6,75.53 U2.1
N$5  (via drill 0.35)
  Top 0.254: R9.P$2 6.6,74.2 6.2,73.8 v5,73.8
  Bottom 0.254: v5,73.8 5,75.63 U5.1
N$6  (via drill 0.35)
  Top 0.254: R19.P$2 12,49.3 11.5,48.8 v10.4,48.8
  Bottom 0.254: v10.4,48.8 10.4,50.42 10.5,50.43 10.75,50.68 U10.1
N$7  (via drill 0.35)
  Top 0.254: R20.P$2 14.7,49.3 14.2,48.8 v13.1,48.8
  Bottom 0.254: v13.1,48.8 13.1,50.5 13.45,50.85 U11.1
N$8  (via drill 0.35)
  Top 0.254: R12.P$2 9.3,49.3 8.7,48.7 v7.6,48.7
  Bottom 0.254: v7.6,48.7 7.6,50.53 U6.1
N$9  (via drill 0.35)
  Top 0.254: R23.P$2 6.6,49.2 6.2,48.8 v5,48.8
  Bottom 0.254: v5,48.8 5,50.63 U12.1
N$13  (via drill 0.35)
  Top 0.254: R27.P$2 12,24.9 11.5,24.4 v10.4,24.4
  Bottom 0.254: v10.4,24.4 10.4,26.02 10.5,26.03 10.75,26.28 U14.1
N$14  (via drill 0.35)
  Top 0.254: R28.P$2 14.7,24.9 14.2,24.4 v13.1,24.4
  Bottom 0.254: v13.1,24.4 13.1,26.1 13.45,26.45 U15.1
N$15  (via drill 0.35)
  Top 0.254: R26.P$2 9.3,24.9 8.7,24.3 v7.6,24.3
  Bottom 0.254: v7.6,24.3 7.6,26.13 U13.1
N$16  (via drill 0.35)
  Top 0.254: R31.P$2 6.6,24.8 6.2,24.4 v5,24.4
  Bottom 0.254: v5,24.4 5,26.23 U16.1
N$17  (via drill 0.35)
  Top 0.254: R35.P$2 27,74.3 26.5,73.8 v25.4,73.8
  Bottom 0.254: v25.4,73.8 25.4,75.42 25.5,75.43 25.75,75.68 U18.1
N$18  (via drill 0.35)
  Top 0.254: R36.P$2 29.7,74.3 29.2,73.8 v28.1,73.8
  Bottom 0.254: v28.1,73.8 28.1,75.5 28.45,75.85 U19.1
N$19  (via drill 0.35)
  Top 0.254: R34.P$2 24.3,74.3 23.7,73.7 v22.6,73.7
  Bottom 0.254: v22.6,73.7 22.6,75.53 U17.1
N$20  (via drill 0.35)
  Top 0.254: R39.P$2 21.6,74.2 21.2,73.8 v20,73.8
  Bottom 0.254: v20,73.8 20,75.63 U20.1
N$21  (via drill 0.35)
  Top 0.254: R43.P$2 27,49.3 26.5,48.8 v25.4,48.8
  Bottom 0.254: v25.4,48.8 25.4,50.42 25.5,50.43 25.75,50.68 U22.1
N$22  (via drill 0.35)
  Top 0.254: R44.P$2 29.7,49.3 29.2,48.8 v28.1,48.8
  Bottom 0.254: v28.1,48.8 28.1,50.5 28.45,50.85 U23.1
N$23  (via drill 0.35)
  Top 0.254: R42.P$2 24.3,49.3 23.7,48.7 v22.6,48.7
  Bottom 0.254: v22.6,48.7 22.6,50.53 U21.1
N$24  (via drill 0.35)
  Top 0.254: R47.P$2 21.6,49.2 21.2,48.8 v20,48.8
  Bottom 0.254: v20,48.8 20,50.63 U24.1
N$25  (via drill 0.35)
  Top 0.254: R51.P$2 27,24.9 26.5,24.4 v25.4,24.4
  Bottom 0.254: v25.4,24.4 25.4,26.02 25.5,26.03 25.75,26.28 U26.1
N$26  (via drill 0.35)
  Top 0.254: R52.P$2 29.7,24.9 29.2,24.4 v28.1,24.4
  Bottom 0.254: v28.1,24.4 28.1,26.1 28.45,26.45 U27.1
N$27  (via drill 0.35)
  Top 0.254: R50.P$2 24.3,24.9 23.7,24.3 v22.6,24.3
  Bottom 0.254: v22.6,24.3 22.6,26.13 U25.1
N$28  (via drill 0.35)
  Top 0.254: R55.P$2 21.6,24.8 21.2,24.4 v20,24.4
  Bottom 0.254: v20,24.4 20,26.23 U28.1
N$29  (via drill 0.35)
  Top 0.254: R59.P$2 42,74.3 41.5,73.8 v40.4,73.8
  Bottom 0.254: v40.4,73.8 40.4,75.42 40.5,75.43 40.75,75.68 U30.1
N$30  (via drill 0.35)
  Top 0.254: R60.P$2 44.7,74.3 44.2,73.8 v43.1,73.8
  Bottom 0.254: v43.1,73.8 43.1,75.5 43.45,75.85 U31.1
N$31  (via drill 0.35)
  Top 0.254: R58.P$2 39.3,74.3 38.7,73.7 v37.6,73.7
  Bottom 0.254: v37.6,73.7 37.6,75.53 U29.1
N$32  (via drill 0.35)
  Top 0.254: R63.P$2 36.6,74.2 36.2,73.8 v35,73.8
  Bottom 0.254: v35,73.8 35,75.63 U32.1
N$33  (via drill 0.35)
  Top 0.254: R67.P$2 42,49.3 41.5,48.8 v40.4,48.8
  Bottom 0.254: v40.4,48.8 40.4,50.42 40.5,50.43 40.75,50.68 U34.1
N$34  (via drill 0.35)
  Top 0.254: R68.P$2 44.7,49.3 44.2,48.8 v43.1,48.8
  Bottom 0.254: v43.1,48.8 43.1,50.5 43.45,50.85 U35.1
N$35  (via drill 0.35)
  Top 0.254: R66.P$2 39.3,49.3 38.7,48.7 v37.6,48.7
  Bottom 0.254: v37.6,48.7 37.6,50.53 U33.1
N$36  (via drill 0.35)
  Top 0.254: R71.P$2 36.6,49.2 36.2,48.8 v35,48.8
  Bottom 0.254: v35,48.8 35,50.63 U36.1
N$37  (via drill 0.35)
  Top 0.254: R75.P$2 42,24.9 41.5,24.4 v40.4,24.4
  Bottom 0.254: v40.4,24.4 40.4,26.02 40.5,26.03 40.75,26.28 U38.1
N$38  (via drill 0.35)
  Top 0.254: R76.P$2 44.7,24.9 44.2,24.4 v43.1,24.4
  Bottom 0.254: v43.1,24.4 43.1,26.1 43.45,26.45 U39.1
N$39  (via drill 0.35)
  Top 0.254: R74.P$2 39.3,24.9 38.7,24.3 v37.6,24.3
  Bottom 0.254: v37.6,24.3 37.6,26.13 U37.1
N$40  (via drill 0.35)
  Top 0.254: R79.P$2 36.6,24.8 36.2,24.4 v35,24.4
  Bottom 0.254: v35,24.4 35,26.23 U40.1
VDD12  (36 unrouted)
  Bottom 0.254: R8.P$2 11.8,56.6 J1.4 | R7.P$2 12.1,61.1 J1.3 | R3.P$2 12.1,65.3 J1.2 | R10.P$2 11.9,69.3 J1.1 | R22.P$2 11.8,31.6 J2.4 | R21.P$2 12.1,36.1 J2.3 | R11.P$2 12.1,40.3 J2.2 | R24.P$2 11.9,44.3 J2.1 | R30.P$2 11.8,7.2 J3.4 | R29.P$2 12.1,11.7 J3.3 | R25.P$2 12.1,15.9 J3.2 | R32.P$2 11.9,19.9 J3.1 | R38.P$2 26.8,56.6 J4.4 | R37.P$2 27.1,61.1 J4.3 | R33.P$2 27.1,65.3 J4.2 | R40.P$2 26.9,69.3 J4.1 | R46.P$2 26.8,31.6 J7.4 | R45.P$2 27.1,36.1 J7.3 | R41.P$2 27.1,40.3 J7.2 | R48.P$2 26.9,44.3 J7.1 | R54.P$2 26.8,7.2 J9.4 | R53.P$2 27.1,11.7 J9.3 | R49.P$2 27.1,15.9 J9.2 | R56.P$2 26.9,19.9 J9.1 | R62.P$2 41.8,56.6 J10.4 | R61.P$2 42.1,61.1 J10.3 | R57.P$2 42.1,65.3 J10.2 | R64.P$2 41.9,69.3 J10.1 | R70.P$2 41.8,31.6 J11.4 | R69.P$2 42.1,36.1 J11.3 | R65.P$2 42.1,40.3 J11.2 | R72.P$2 41.9,44.3 J11.1 | R78.P$2 41.8,7.2 J12.4 | R77.P$2 42.1,11.7 J12.3 | R73.P$2 42.1,15.9 J12.2 | R80.P$2 41.9,19.9 J12.1